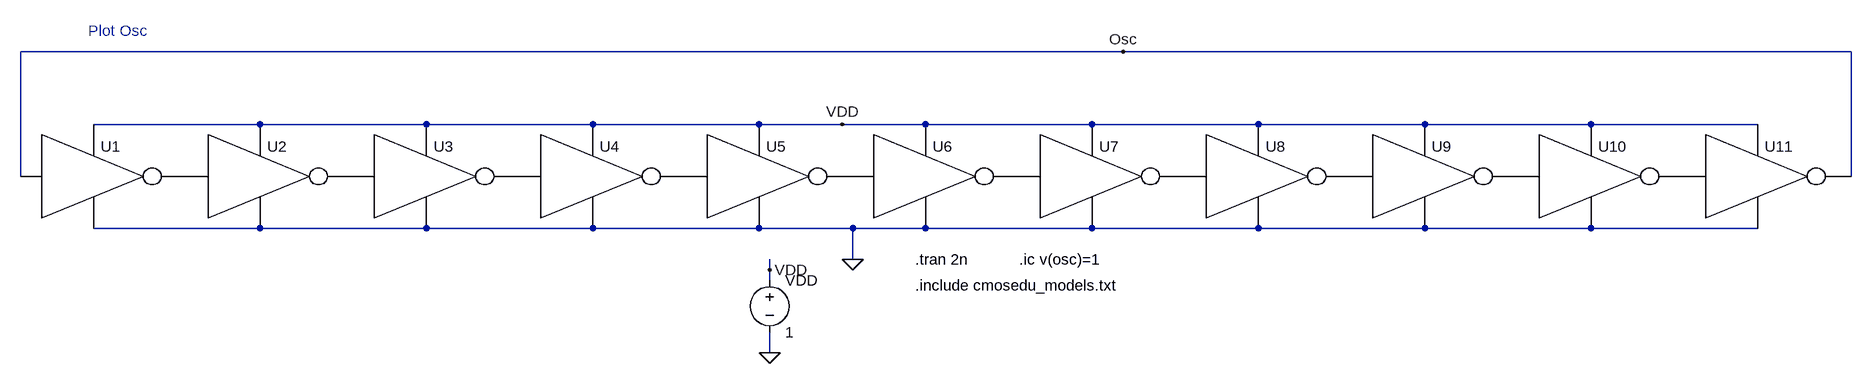
[diagram p0: schematic Fig11_14_symbol.asc]
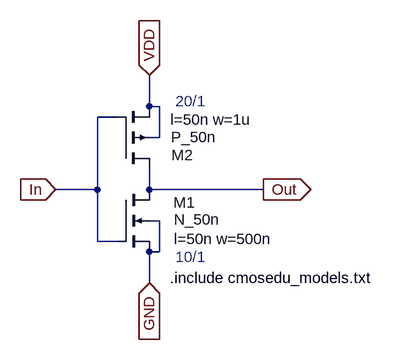
[diagram p1: sub-circuit inv_20_10.asc]
Fig11_14_symbol.asc, the LTspice schematic file:
Version 4
SHEET 1 3252 680
WIRE 2128 -448 432 -448
WIRE 3248 -448 2128 -448
WIRE 800 -336 544 -336
WIRE 1056 -336 800 -336
WIRE 1312 -336 1056 -336
WIRE 1568 -336 1312 -336
WIRE 1696 -336 1568 -336
WIRE 1824 -336 1696 -336
WIRE 2080 -336 1824 -336
WIRE 2336 -336 2080 -336
WIRE 2592 -336 2336 -336
WIRE 2848 -336 2592 -336
WIRE 3104 -336 2848 -336
WIRE 432 -256 432 -448
WIRE 3248 -256 3248 -448
WIRE 800 -176 544 -176
WIRE 1056 -176 800 -176
WIRE 1312 -176 1056 -176
WIRE 1568 -176 1312 -176
WIRE 1712 -176 1568 -176
WIRE 1824 -176 1712 -176
WIRE 2080 -176 1824 -176
WIRE 2336 -176 2080 -176
WIRE 2592 -176 2336 -176
WIRE 2848 -176 2592 -176
WIRE 3104 -176 2848 -176
WIRE 1712 -128 1712 -176
WIRE 1584 -112 1584 -128
WIRE 1584 -96 1584 -112
WIRE 1584 16 1584 -16
FLAG 1584 16 0
FLAG 1584 -112 VDD
FLAG 1712 -128 0
FLAG 1696 -336 VDD
FLAG 2128 -448 Osc
SYMBOL voltage 1584 -112 R0
WINDOW 123 0 0 Left 0
WINDOW 39 0 0 Left 0
SYMATTR InstName VDD
SYMATTR Value 1
SYMBOL INV_20_10 464 -320 R0
SYMATTR InstName U1
SYMBOL INV_20_10 720 -320 R0
SYMATTR InstName U2
SYMBOL INV_20_10 976 -320 R0
SYMATTR InstName U3
SYMBOL INV_20_10 1232 -320 R0
SYMATTR InstName U4
SYMBOL INV_20_10 1488 -320 R0
SYMATTR InstName U5
SYMBOL INV_20_10 1744 -320 R0
SYMATTR InstName U6
SYMBOL INV_20_10 2000 -320 R0
SYMATTR InstName U7
SYMBOL INV_20_10 2256 -320 R0
SYMATTR InstName U8
SYMBOL INV_20_10 2512 -320 R0
SYMATTR InstName U9
SYMBOL INV_20_10 2768 -320 R0
SYMATTR InstName U10
SYMBOL INV_20_10 3024 -320 R0
SYMATTR InstName U11
TEXT 1808 -128 Left 0 !.tran 2n
TEXT 1808 -88 Left 0 !.include cmosedu_models.txt
TEXT 536 -480 Left 0 ;Plot Osc
TEXT 1968 -128 Left 0 !.ic v(osc)=1

inv_20_10.asc, the sub-circuit schematic file:
Version 4
SHEET 1 1136 680
WIRE 448 -304 448 -352
WIRE 464 -304 448 -304
WIRE 400 -288 368 -288
WIRE 464 -256 464 -304
WIRE 464 -256 448 -256
WIRE 368 -176 368 -288
WIRE 368 -176 304 -176
WIRE 448 -176 448 -208
WIRE 624 -176 448 -176
WIRE 464 -128 448 -128
WIRE 368 -96 368 -176
WIRE 400 -96 368 -96
WIRE 464 -80 464 -128
WIRE 464 -80 448 -80
WIRE 448 -32 448 -80
FLAG 304 -176 In
IOPIN 304 -176 In
FLAG 448 -352 VDD
IOPIN 448 -352 In
FLAG 448 -32 GND
IOPIN 448 -32 In
FLAG 624 -176 Out
IOPIN 624 -176 Out
SYMBOL nmos4 400 -176 R0
WINDOW 0 119 20 Right 2
WINDOW 3 157 46 Right 2
WINDOW 123 238 76 Right 2
SYMATTR InstName M1
SYMATTR Value N_50n
SYMATTR Value2 l=50n w=500n
SYMBOL pmos4 400 -208 M180
WINDOW 0 116 21 Right 2
WINDOW 3 151 49 Right 2
WINDOW 123 206 76 Right 2
SYMATTR InstName M2
SYMATTR Value P_50n
SYMATTR Value2 l=50n w=1u
TEXT 488 -312 Left 2 ;20/1
TEXT 488 -72 Left 2 ;10/1
TEXT 480 -40 Left 2 !.include cmosedu_models.txt

The netlist it stands for:
* Fig11_14_symbol.asc
VDD VDD 0 1
XU1 Osc P001 VDD 0 inv_20_10
XU2 P001 P002 VDD 0 inv_20_10
XU3 P002 P003 VDD 0 inv_20_10
XU4 P003 P004 VDD 0 inv_20_10
XU5 P004 P005 VDD 0 inv_20_10
XU6 P005 P006 VDD 0 inv_20_10
XU7 P006 P007 VDD 0 inv_20_10
XU8 P007 P008 VDD 0 inv_20_10
XU9 P008 P009 VDD 0 inv_20_10
XU10 P009 P010 VDD 0 inv_20_10
XU11 P010 Osc VDD 0 inv_20_10

* block symbol definitions
.subckt inv_20_10 In Out VDD GND
M1 Out In GND GND N_50n l=50n w=500n
M2 Out In VDD VDD P_50n l=50n w=1u
* 20/1
* 10/1
.include cmosedu_models.txt
.ends inv_20_10

.model NMOS NMOS
.model PMOS PMOS
.lib standard.mos
.tran 2n
.include cmosedu_models.txt
* Plot Osc
.ic v(osc)=1
.backanno
.end